# Altium schematic sheet 1_ESP32.schdoc
size 307 x 218 mm; Symbol: Sheet-Symbol_A4; Device: Sheet-Symbol_A4; @Project Name: 2026_ALTIS_V2.0; @Page Count: 3; @Update Date: 2026-04-05; @Create Date: 2026-04-05; @Schematic Name: 2026_ALTIS; @Page No: 1; @Page Name: ESP32; Company: EasyEDA.com; Version: V2.0; Page Size: A4; @Create Time: 05:22:19; @Update Time: 14:22:30; @Board Name: 2026_ALTIS; Width: 1170; Height: 825; Region Start: 1; X Region Count: 6; Y Region Count: 4; Blade Width: 10; Title Block Position: 3
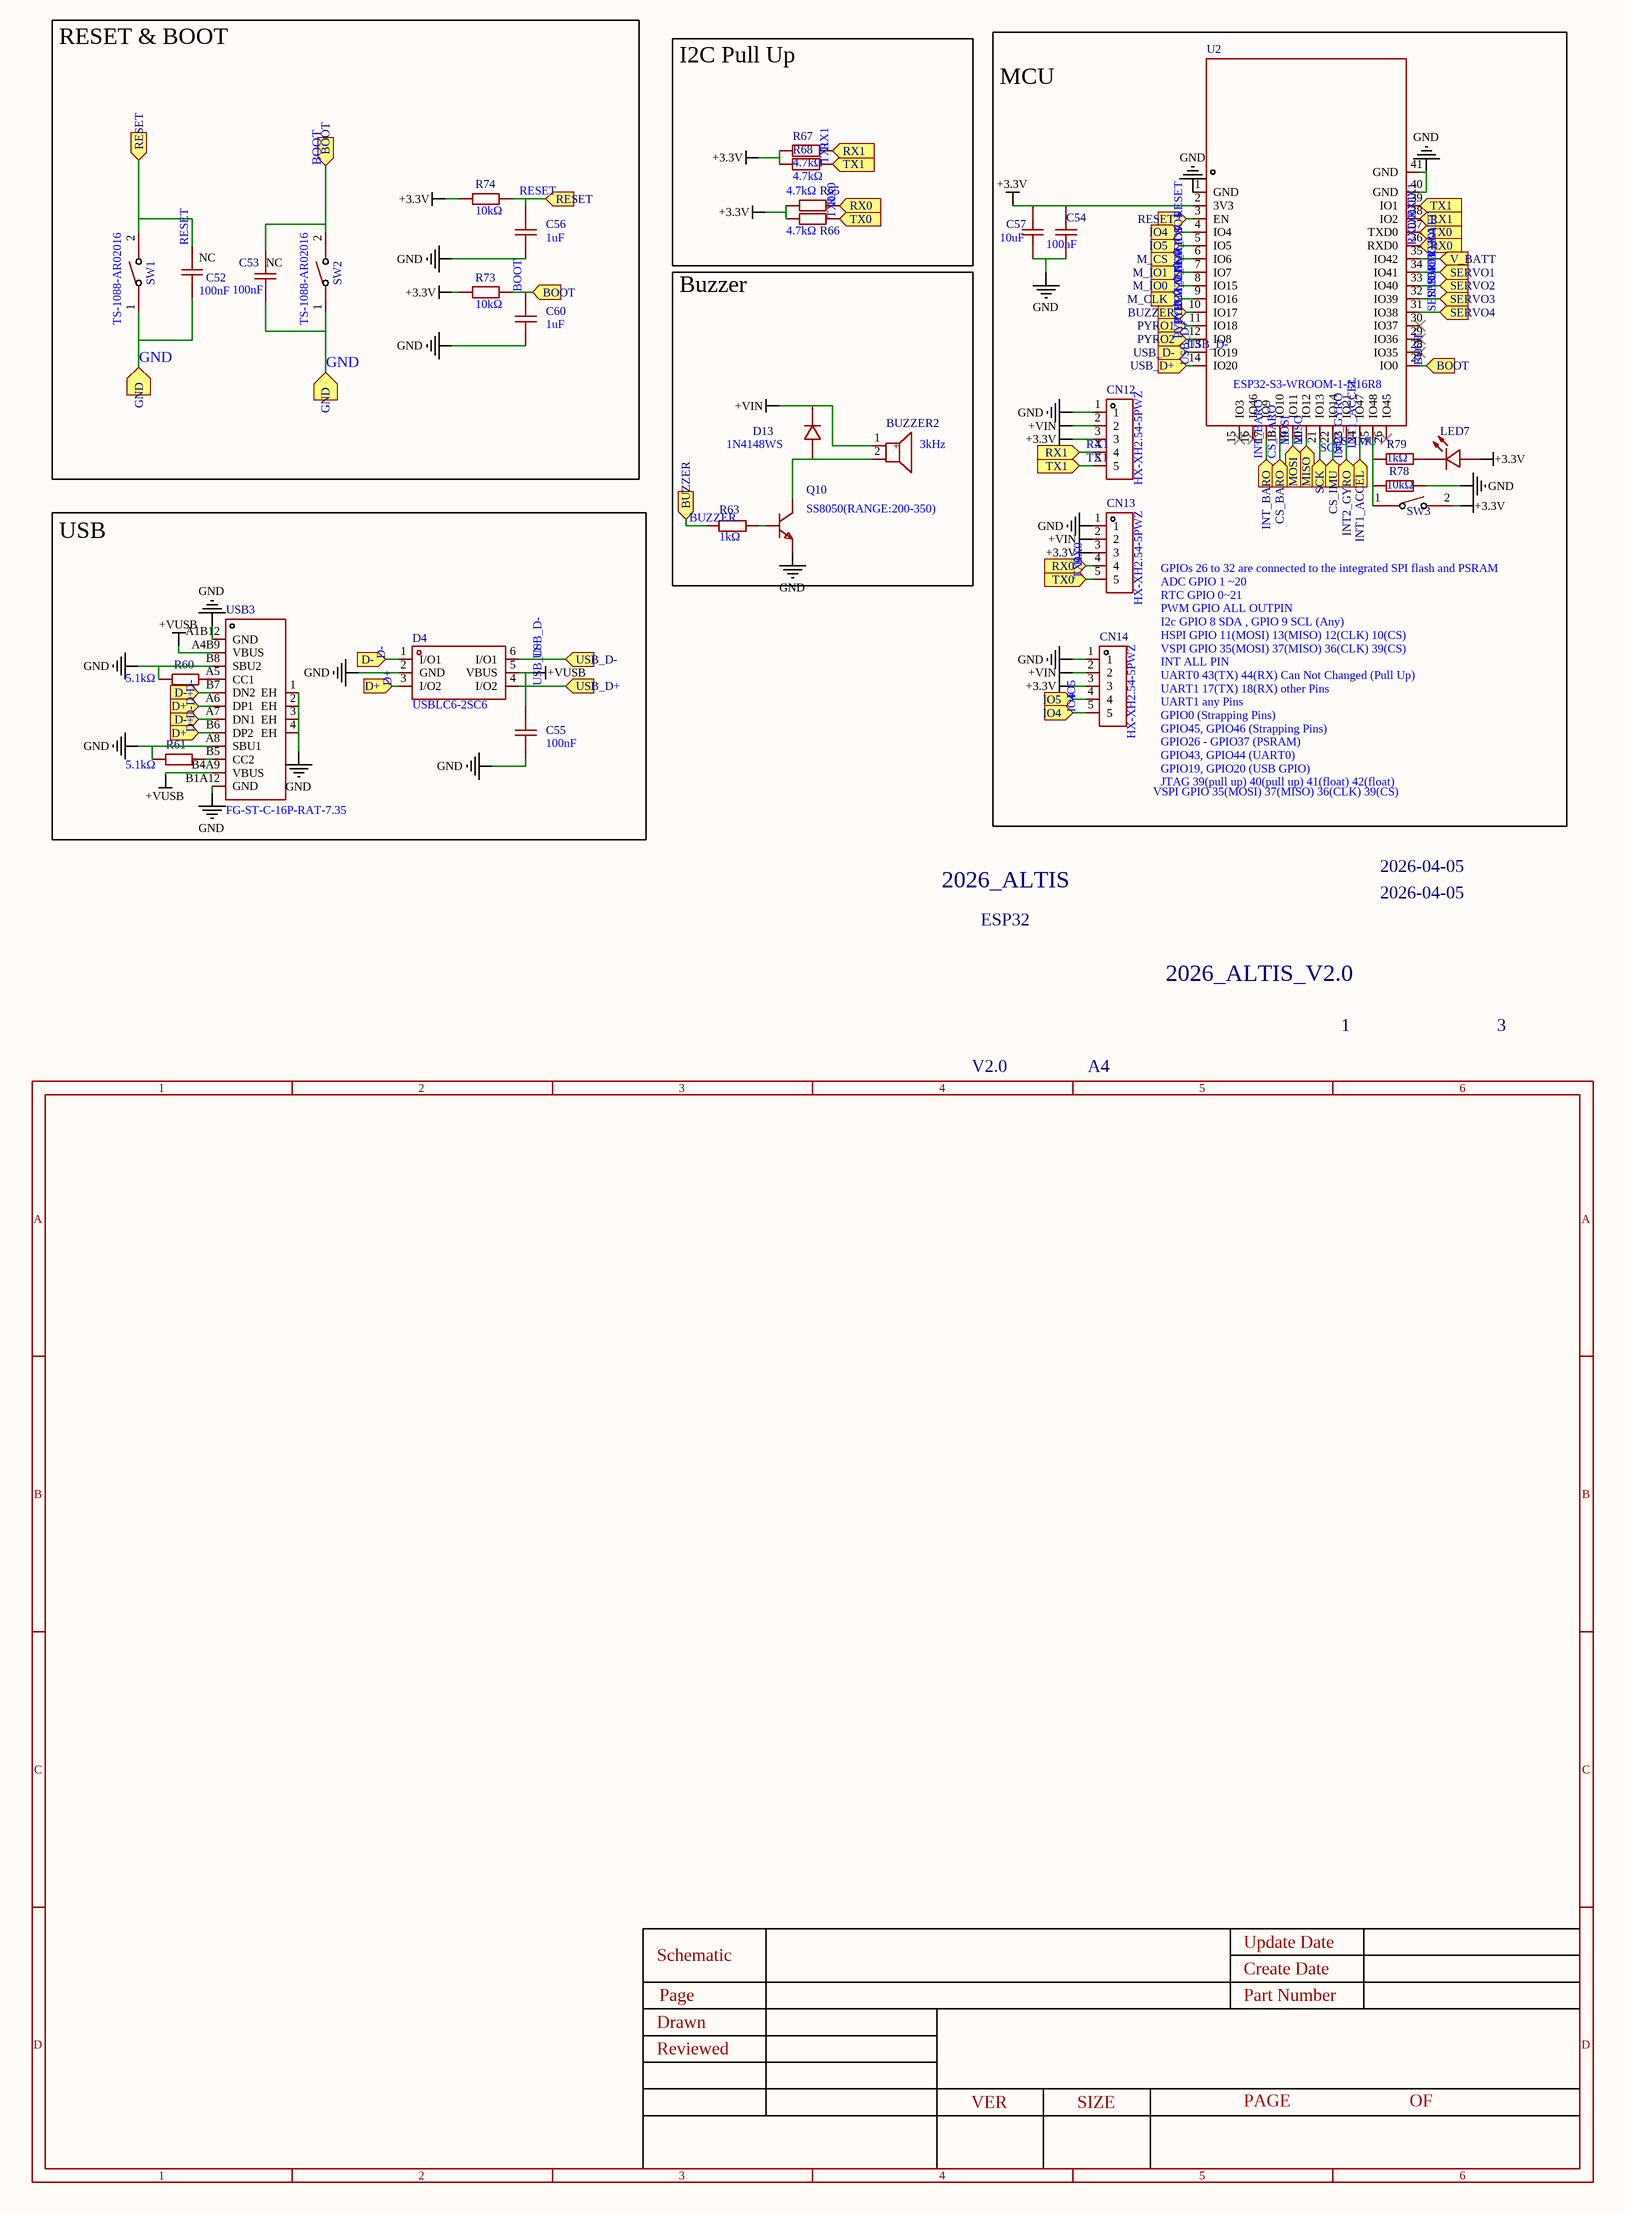
[diagram p0: 1_ESP32.schdoc]

## Parts
BUZZER2  3kHz  [BUZ-TH_BD9.6-P5.00-D0.7-FD]
C52  100nF  [C0603]
C53  100nF  [C0603]
C54  100nF  [C0603]
C55  100nF  [C0603]
C56  1uF  [C0603]
C57  10uF  [C0603]
C60  1uF  [C0603]
CN12  HX-XH2.54-5PWZ  [CONN-TH_HX-XH2.54-5PWZ]
CN13  HX-XH2.54-5PWZ  [CONN-TH_HX-XH2.54-5PWZ]
CN14  HX-XH2.54-5PWZ  [CONN-TH_HX-XH2.54-5PWZ]
D4  USBLC6-2SC6  [SOT-23-6_L2.9-W1.6-P0.95-LS2.8-BL]
D13  1N4148WS  [SOD-323_L1.8-W1.3-LS2.5-RD]
LED7  KT-0603R  [LED0603-RD]  (value not drawn)
Q10  SS8050(RANGE:200-350)  [SOT-23-3_L2.9-W1.3-P1.90-LS2.4-BR]
R60  5.1kΩ  [R0603]
R61  5.1kΩ  [R0603]
R63  1kΩ  [R0603]
R65  4.7kΩ  [R0603]
R66  4.7kΩ  [R0603]
R67  4.7kΩ  [R0603]
R68  4.7kΩ  [R0603]
R73  10kΩ  [R0603]
R74  10kΩ  [R0603]
R78  10kΩ  [R0603]
R79  1kΩ  [R0603]
SW1  TS-1088-AR02016  [SW-SMD_L3.9-W3.0-P4.45]
SW2  TS-1088-AR02016  [SW-SMD_L3.9-W3.0-P4.45]
SW3  TS-1088-AR02016  [SW-SMD_L3.9-W3.0-P4.45]  (value not drawn)
U2  ESP32-S3-WROOM-1-N16R8  [WIRELM-SMD_ESP32-S3-WROOM-1]
USB3  FG-ST-C-16P-RAT-7.35  [USB-C-SMD_FG-ST-C-16P-RAT-7.35]

## Blocks framed on the sheet
RESET & BOOT: C52 C53 C56 C60 R73 R74 SW1 SW2
I2C Pull Up: R65-R68
MCU: C54 C57 CN12-CN14 LED7 R78 R79 SW3 U2
Buzzer: BUZZER2 D13 Q10 R63
USB: C55 D4 R60 R61 USB3

## Ports
BOOT (in), BUZZER (in), CS_BARO (in), CS_IMU (in), D+ (in), D- (in), GND (in), INT1_ACCEL (in), INT2_GYRO (in), INT_BARO (in), IO4 (in), IO5 (in), M_CLK (in), M_CS (in), M_IO0 (in), M_IO1 (in), MISO (in), MOSI (in), PYRO1 (in), PYRO2 (in), RESET (in), RX0 (in), RX1 (in), SCK (in), SERVO1 (in), SERVO2 (in), SERVO3 (in), SERVO4 (in), TX0 (in), TX1 (in), USB_D+ (in), USB_D- (in), V_BATT (in)

## Nets
+3.3V: C54.2 C57.2 CN12.3 CN13.3 CN14.3 LED7.2(A) R65.2 R66.2 R67.2 R68.2 R73.2 R74.2 SW3.2 U2.2(3V3)
+VIN: BUZZER2.1(+) CN12.2 CN13.2 CN14.2 D13.1(K)
+VUSB: C55.2 D4.5(VBUS) USB3.A4B9(VBUS) USB3.B4A9(VBUS)
GND: C52.1 C53.1 C54.1 C55.1 C56.1 C57.1 C60.1 CN12.1 CN13.1 CN14.1 D4.2(GND) Q10.2(E) R60.2 R61.2 R78.1 SW1.1 SW2.1 U2.1(GND) U2.40(GND) U2.41(GND) USB3.1(EH) USB3.2(EH) USB3.3(EH) USB3.4(EH) USB3.A1B12(GND) USB3.A8(SBU1) USB3.B1A12(GND) USB3.B8(SBU2) ; port GND
BOOT: C53.2 C60.2 R73.1 SW2.2 U2.27(IO0) ; port BOOT
BUZZER: R63.1 U2.10(IO17) ; port BUZZER
CS_BARO: U2.18(IO10) ; port CS_BARO
CS_IMU: U2.22(IO14) ; port CS_IMU
D+: D4.3(I/O2) USB3.A6(DP1) USB3.B6(DP2) ; port D+
D-: D4.1(I/O1) USB3.A7(DN1) USB3.B7(DN2) ; port D-
INT1_ACCEL: U2.24(IO47) ; port INT1_ACCEL
INT2_GYRO: U2.23(IO21) ; port INT2_GYRO
INT_BARO: U2.17(IO9) ; port INT_BARO
IO4: CN14.5 U2.4(IO4) ; port IO4
IO5: CN14.4 U2.5(IO5) ; port IO5
M_CLK: U2.9(IO16) ; port M_CLK
M_CS: U2.6(IO6) ; port M_CS
M_IO0: U2.8(IO15) ; port M_IO0
M_IO1: U2.7(IO7) ; port M_IO1
MISO: U2.20(IO12) ; port MISO
MOSI: U2.19(IO11) ; port MOSI
PYRO1: U2.11(IO18) ; port PYRO1
PYRO2: U2.12(IO8) ; port PYRO2
RESET: C52.2 C56.2 R74.1 SW1.2 U2.3(EN) ; port RESET
RX0: CN13.4 R65.1 U2.36(RXD0) ; port RX0
RX1: CN12.4 R67.1 U2.38(IO2) ; port RX1
SCK: U2.21(IO13) ; port SCK
SERVO1: U2.34(IO41) ; port SERVO1
SERVO2: U2.33(IO40) ; port SERVO2
SERVO3: U2.32(IO39) ; port SERVO3
SERVO4: U2.31(IO38) ; port SERVO4
TX0: CN13.5 R66.1 U2.37(TXD0) ; port TX0
TX1: CN12.5 R68.1 U2.39(IO1) ; port TX1
USB_D+: D4.4(I/O2) U2.14(IO20) ; port USB_D+
USB_D-: D4.6(I/O1) U2.13(IO19) ; port USB_D-
V_BATT: U2.35(IO42) ; port V_BATT
NetBUZZER2_2: BUZZER2.2 D13.2(A) Q10.3(C)
NetLED7_1: LED7.1(K) R79.1
NetQ10_1: Q10.1(B) R63.2
NetR60_1: R60.1 USB3.A5(CC1)
NetR61_1: R61.1 USB3.B5(CC2)
NetR78_2: R78.2 R79.2 SW3.1 U2.25(IO48)

Not connected (* = marked no-connect by the designer): U2 15(IO3)* 16(IO46)* 26(IO45)* 28(IO35)* 29(IO36)* 30(IO37)*

## Notes on the sheet
- (near C52) NC
- (near C53) NC
- GPIOs 26 to 32 are connected to the integrated SPI flash and PSRAM
  ADC GPIO 1 ~20
  RTC GPIO 0~21
  PWM GPIO ALL OUTPIN
  I2c GPIO 8 SDA , GPIO 9 SCL (Any)
  HSPI GPIO 11(MOSI) 13(MISO) 12(CLK) 10(CS)
  VSPI GPIO 35(MOSI) 37(MISO) 36(CLK) 39(CS)
  INT ALL PIN
  UART0 43(TX) 44(RX) Can Not Changed (Pull Up)
  UART1 17(TX) 18(RX) other Pins
  UART1 any Pins
  GPIO0 (Strapping Pins)
  GPIO45, GPIO46 (Strapping Pins)
  GPIO26 - GPIO37 (PSRAM)
  GPIO43, GPIO44 (UART0)
  GPIO19, GPIO20 (USB GPIO)
  JTAG 39(pull up) 40(pull up) 41(float) 42(float)
- VSPI GPIO 35(MOSI) 37(MISO) 36(CLK) 39(CS)
- 2026_ALTIS
- 2026-04-05
- ESP32
- 2026_ALTIS_V2.0
- 1
- 3
- 2
- 4
- V2.0
- A4
- 5
- 6
- A
- B
- C
- Schematic
- Create Date
- Update Date
- Drawn
- Page
- Part Number
- D
- Reviewed
- VER
- SIZE
- PAGE
- OF

## Library data of the parts
BUZZER2 = HNB09A05: Manufacturer: 华能; Add into BOM: yes; Driver Circuitry: Active Buzzer (Built-in Driving Circuit); Voltage - Supply: 3V~7V; Sound Pressure Level(SPL): 85dB; Symbol: HNB09A05; Device: HNB09A05; LCSC Part Name: HNB09A05; Supplier Part: C96493; Manufacturer Part: HNB09A05; Supplier Footprint: 插件,D=9mm; JLCPCB Part Class: Extended Part; Datasheet: https://item.szlcsc.com/datasheet/HNB09A05/97698.html; Supplier: LCSC; Convert to PCB: yes; Technology: Electromagnetic; Voltage Rating: -; Value: 3kHz; Current Consumption: -; Diameter(φD): 9mm; Length: -; Width: -; Height: 5.7mm; Operating Temperature: -
C52-C55 = CC0603KRX7R9BB104: Manufacturer: YAGEO(国巨); Add into BOM: yes; Tolerance: ±10%; Voltage Rating: 50V; Temperature Coefficient: X7R; Symbol: CC0603KRX7R9BB104; Device: CC0603KRX7R9BB104; LCSC Part Name: 100nF ±10% 50V; Supplier Part: C14663; Manufacturer Part: CC0603KRX7R9BB104; Supplier Footprint: 0603; Datasheet: https://item.szlcsc.com/datasheet/CC0603KRX7R9BB104/15331.html; Supplier: LCSC; Convert to PCB: yes; Value: 100nF
C56 C60 = CL10A105KB8NNNC: Manufacturer: SAMSUNG(三星); Add into BOM: yes; Tolerance: ±10%; Voltage Rating: 50V; Temperature Coefficient: X5R; Symbol: CL10A105KB8NNNC; Device: CL10A105KB8NNNC; LCSC Part Name: 1uF ±10% 50V; Supplier Part: C15849; Manufacturer Part: CL10A105KB8NNNC; Supplier Footprint: 0603; JLCPCB Part Class: Basic Part; Datasheet: https://item.szlcsc.com/datasheet/CL10A105KB8NNNC/16531.html; Supplier: LCSC; Convert to PCB: yes; Value: 1uF
C57 = CL10A106KP8NNNC: Manufacturer: SAMSUNG(三星); Add into BOM: yes; Tolerance: ±10%; Voltage Rating: 10V; Temperature Coefficient: X5R; Symbol: CL10A106KP8NNNC; Device: CL10A106KP8NNNC; LCSC Part Name: 10uF ±10% 10V; Supplier Part: C19702; Manufacturer Part: CL10A106KP8NNNC; Supplier Footprint: 0603; Datasheet: https://item.szlcsc.com/datasheet/CL10A106KP8NNNC/20411.html; Supplier: LCSC; Convert to PCB: yes; Value: 10uF
CN12-CN14 = HX-XH2.54-5PWZ: Manufacturer: hanxia(韩下); Add into BOM: no; Convert to PCB: yes; Pins Structure: 1x5P; Pitch: 2.5mm; Reference Series: XH; Number of PINs Per Row: 5; Current Rating: 3A; Voltage Rating: 250V; Plastic Material: PA66; Flame Retardant Rating: UL94V-0; Symbol: HX-XH2.54-5PWZ; Device: HX-XH2.54-5PWZ; LCSC Part Name: 1x5P 间距:2.5mm 弯插 系列:XH; Supplier Part: C48641717; Manufacturer Part: HX-XH2.54-5PWZ; Supplier Footprint: 弯插,P=2.5mm; JLCPCB Part Class: Extended Part; Datasheet: https://item.szlcsc.com/datasheet/HX-XH2.54-5PWZ/50919913.html; Supplier: LCSC; Mounting Type: Right Angle; Number of Pins: 5P; Number of Rows: 1; Row Spacing: -; Contact Material: Brass; Contact Plating: Tin; Operating Temperature: -25℃~+85℃; Color: White
D4 = USBLC6-2SC6_C2687116: Manufacturer: UMW(友台半导体); Add into BOM: yes; Maximum Clamping Voltage: 15V; Breakdown Voltage: 6V; Number of Lines: 双路; Type: ESD; Symbol: USBLC6-2SC6_C2687116; Device: USBLC6-2SC6_C2687116; LCSC Part Name: USBLC6-2SC6; Supplier Part: C2687116; Manufacturer Part: USBLC6-2SC6; Supplier Footprint: SOT-23-6; JLCPCB Part Class: Extended Part; Datasheet: https://atta.szlcsc.com/upload/public/pdf/source/20231109/512642D850D9873E7C519F71E85B9A10.pdf; Supplier: LCSC; Convert to PCB: yes
D13 = 1N4148WS_C2128: Manufacturer: CJ(江苏长电/长晶); Symbol: 1N4148WS T4; Add into BOM: yes; Diode Configuration: Independent; Voltage - Forward(Vf@If): 1.25V@150mA; Voltage - DC Reverse(Vr): 100V; Current - Rectified: 150mA; Pd - Power Dissipation: 200mW; Reverse Leakage Current (Ir): 1uA@75V; Reverse Recovery Time (trr): 4ns; Non-Repetitive Peak Forward Surge Current: 2A; Device: 1N4148WS_C2128; LCSC Part Name: 丝印T4 1N4148WS; Supplier Part: C2128; Manufacturer Part: 1N4148WS; Supplier Footprint: SOD-323; Datasheet: https://item.szlcsc.com/datasheet/1N4148WS/2485.html; Supplier: LCSC; Convert to PCB: yes; Operating Junction Temperature Range: -
LED7 = KT-0603R: Manufacturer: KENTO; Add into BOM: yes; Emitted Color: Red; Symbol: KT-0603R; Device: KT-0603R; LCSC Part Name: 0603 红灯 高亮; Supplier Part: C2286; Manufacturer Part: KT-0603R; Supplier Footprint: 0603; JLCPCB Part Class: Basic Part; Datasheet: https://atta.szlcsc.com/upload/public/pdf/source/20160616/1466072038404.pdf; Supplier: LCSC; Convert to PCB: yes; Power Dissipation: -; Forward Current: -; Dominant Wavelength: -; Peak Wavelength: -; Diode Configuration: -; Lens Color: -; Color Temperature: -; Viewing Angle: -; Mounting Sytle: -; Operating Temperature: -40℃~+85℃
Q10 = SS8050(RANGE:200-350)_C2150: Manufacturer: CJ(江苏长电/长晶); Symbol: SS8050_C2150; Add into BOM: yes; type: NPN; Current - Collector(Ic): 1.5A; Collector - Emitter Voltage VCEO: 25V; Pd - Power Dissipation: 300mW; DC Current Gain: 200@800mA,1V; Transition frequency(fT): 100MHz; Current - Collector Cutoff: 100nA; Vce Saturation(VCE(sat)): 500mV@800mA,80mA; Emitter-Base Voltage(Vebo): 5V; Number: 1 NPN; Device: SS8050(RANGE:200-350)_C2150; LCSC Part Name: hfe=200~350 NPN 电流:1.5A 电压:25V; Supplier Part: C2150; Manufacturer Part: SS8050(RANGE:200-350); Supplier Footprint: SOT-23; JLCPCB Part Class: Basic Part; Datasheet: https://item.szlcsc.com/datasheet/SS8050(RANGE%253A200-350)/2507.html; Supplier: LCSC; Convert to PCB: yes; Operating Temperature: -55℃~+150℃
R60 R61 = 0603WAF5101T5E: Manufacturer: UNI-ROYAL(厚声); Add into BOM: yes; Tolerance: ±1%; Power(Watts): 100mW; Voltage-Supply(Max): 75V; Temperature Coefficient: ±100ppm/℃; Symbol: 0603WAF5101T5E; Device: 0603WAF5101T5E; LCSC Part Name: 5.1kΩ ±1% 100mW 厚膜电阻; Supplier Part: C23186; Manufacturer Part: 0603WAF5101T5E; Supplier Footprint: 0603; JLCPCB Part Class: Basic Part; Datasheet: https://item.szlcsc.com/datasheet/0603WAF5101T5E/23913.html; Supplier: LCSC; Convert to PCB: yes; Type: Thick Film Resistor; Value: 5.1kΩ; Operating Temperature: -55℃~+155℃
R63 R79 = 0603WAF1001T5E: Manufacturer: UNI-ROYAL(厚声); Add into BOM: yes; Tolerance: ±1%; Power(Watts): 100mW; Voltage-Supply(Max): 75V; Temperature Coefficient: ±100ppm/℃; Symbol: 0603WAF1001T5E; Device: 0603WAF1001T5E; LCSC Part Name: 1kΩ ±1% 100mW 厚膜电阻; Supplier Part: C21190; Manufacturer Part: 0603WAF1001T5E; Supplier Footprint: 0603; JLCPCB Part Class: Basic Part; Datasheet: https://item.szlcsc.com/datasheet/0603WAF1001T5E/21904.html; Supplier: LCSC; Convert to PCB: yes; Type: Thick Film Resistor; Value: 1kΩ; Operating Temperature: -55℃~+155℃
R65-R68 = 0603WAF4701T5E: Manufacturer: UNI-ROYAL(厚声); Add into BOM: yes; Tolerance: ±1%; Power(Watts): 100mW; Voltage-Supply(Max): 75V; Temperature Coefficient: ±100ppm/℃; Symbol: 0603WAF4701T5E; Device: 0603WAF4701T5E; LCSC Part Name: 4.7kΩ ±1% 100mW 厚膜电阻; Supplier Part: C23162; Manufacturer Part: 0603WAF4701T5E; Supplier Footprint: 0603; JLCPCB Part Class: Basic Part; Datasheet: https://item.szlcsc.com/datasheet/0603WAF4701T5E/23889.html; Supplier: LCSC; Convert to PCB: yes; Type: Thick Film Resistor; Value: 4.7kΩ; Operating Temperature: -55℃~+155℃
R73 R74 R78 = 0603WAF1002T5E: Manufacturer: UNI-ROYAL(厚声); Add into BOM: yes; Tolerance: ±1%; Power(Watts): 100mW; Voltage-Supply(Max): 75V; Temperature Coefficient: ±100ppm/℃; Symbol: 0603WAF1002T5E; Device: 0603WAF1002T5E; LCSC Part Name: 厚膜电阻 10kΩ ±1% 100mW; Supplier Part: C25804; Manufacturer Part: 0603WAF1002T5E; Supplier Footprint: 0603; JLCPCB Part Class: Basic Part; Datasheet: https://item.szlcsc.com/datasheet/0603WAF1002T5E/26547.html; Supplier: LCSC; Convert to PCB: yes; Type: Thick Film Resistor; Value: 10kΩ; Operating Temperature: -55℃~+155℃
SW1-SW3 = TS-1088-AR02016: Manufacturer: XUNPU(讯普); Add into BOM: yes; Circuit: SPST; Actuator Style: Round Button; Operating Force: 1.6N; Switch Height: 2mm; with Bracket: Without Bracket; Contact Current: 50mA; Voltage Rating: 12V; Actuator/Cap Color: Black; Life: 100,000 Cycles; Symbol: TS-1088-AR02016; Device: TS-1088-AR02016; LCSC Part Name: 4*3*2mm 立贴 轻触开关; Supplier Part: C720477; Manufacturer Part: TS-1088-AR02016; Supplier Footprint: SMD,4x3mm; Datasheet: https://item.szlcsc.com/datasheet/TS-1088-AR02016/763484.html; Supplier: LCSC; Convert to PCB: yes; Mounting Type: Surface Mount,Vertical; Length: 4mm; Width: 3mm; Termination Style: SMD(SMT) Tab; Operating Temperature: -30℃~+80℃
U2 = ESP32-S3-WROOM-1-N16R8: Manufacturer: ESPRESSIF(乐鑫); Symbol: ESP32-S3-WROOM-1(N16R8); Add into BOM: yes; Device: ESP32-S3-WROOM-1-N16R8; LCSC Part Name: 通用型Wi-Fi+低功耗蓝牙MCU模组; Supplier Part: C2913202; Manufacturer Part: ESP32-S3-WROOM-1-N16R8; Supplier Footprint: SMD,25.5x18mm; JLCPCB Part Class: Extended Part; Datasheet: https://item.szlcsc.com/datasheet/ESP32-S3-WROOM-1-N16R8/3198300.html; Supplier: LCSC; Convert to PCB: yes
USB3 = FG-ST-C-16P-RAT-7.35: Manufacturer: FG(富港); Add into BOM: yes; Connector Type: Type-C; Gender: Female; Number of Contacts: 16P; Number of Ports: 1; Connect-Disconnect Life: 10,000 cycles; Detection color: Black; Symbol: FG-ST-C-16P-RAT-7.35; Device: FG-ST-C-16P-RAT-7.35; LCSC Part Name: Type-C 母 卧贴; Supplier Part: C51911914; Manufacturer Part: FG-ST-C-16P-RAT-7.35; Supplier Footprint: SMD; JLCPCB Part Class: Extended Part; Datasheet: https://item.szlcsc.com/datasheet/FG-ST-C-16P-RAT-7.35/54613011.html; Supplier: LCSC; Convert to PCB: yes; Mounting Type: Surface Mount, Right Angle; Length: 7.35mm; Operating Temperature: -40℃~+85℃